# Altium project tclab_v1i1.PrjPcb (part 4 of 4)

## Sheet A6_fan_indicator.SchDoc
size A4; SheetNumber: 6; SheetTotal: 6
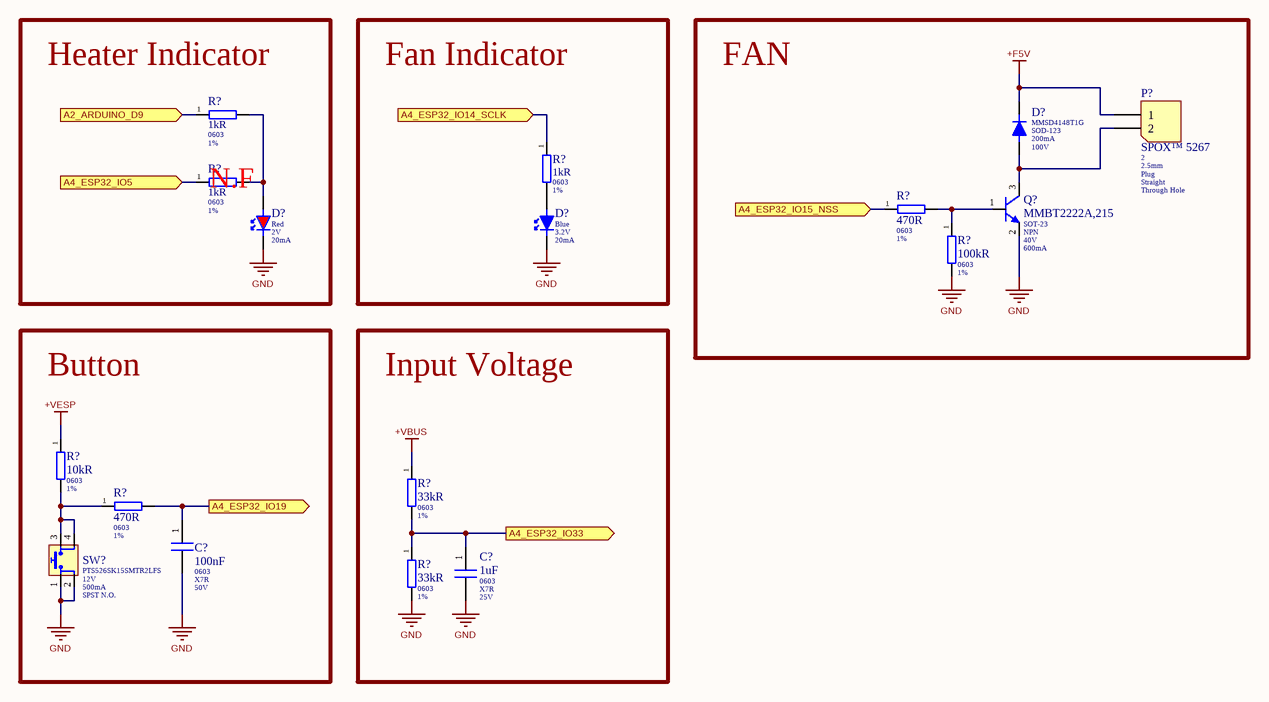
[diagram p5: A6_fan_indicator.SchDoc]

### Parts
(Parts that share a designator on the sheet are numbered #1, #2 ... from top to bottom, then left to right.)
C?#19  Capacitance: 100nF  Case/Package: 0603  Dielectric: X7R  Voltage Rating (DC): 50V  [CAPC1608X09N]  (hidden comment: CAP-CER_100n_50V_20%_X7R_0603)
C?#20  Capacitance: 1uF  Case/Package: 0603  Dielectric: X7R  Voltage: 25V  [CAPC1608X10N]  (hidden comment: CAP-CER_1u_25V_10%_X7R_0603)
D?#3  MFG PN: MMSD4148T1G  Case/Package: SOD-123  Forward Current: 200mA  Reverse Voltage: 100V  [ONSEMI_MMSD4148T1G]  (hidden comment: DIO-F_1000mV_100V_200mA_SOD123)
D?#4  Color: Red  Forward Voltage: 2V  Test Current: 20mA  [LEDC1608X08N_R]  (hidden comment: LED_red_2V_20mA_0603)
D?#5  Color: Blue  Forward Voltage: 3.2V  Test Current: 20mA  [LEDC1608X08N_B]  (hidden comment: LED_blue_3.2V_20mA_0603)
P?#10  Series: SPOX™ 5267  Number of Circuits: 2  Pitch: 2.5mm  _Mating_Type: Plug  Orientation: Straight  Mounting Technology: Through Hole  [MOLEX_22035025]  (hidden comment: CON-5267_02_250_plug_ST_TH)
Q?#7  MFG PN: MMBT2222A,215  Case/Package: SOT-23  Polarity: NPN  Collector Emitter Voltage (VCEO): 40V  Max Collector Current: 600mA  [SOT95P230X110-3N]  (hidden comment: TRNS-NPN_40V_600mA_SOT-23)
R?#49  Resistance: 1kR  Case/Package: 0603  Tolerance: 1%  [RESC1608X06N]  (hidden comment: RES_1K_100mW_1%_0603)
R?#50  Resistance: 1kR  Case/Package: 0603  Tolerance: 1%  [RESC1608X06N]  (hidden comment: RES_1K_100mW_1%_0603)
R?#51  Resistance: 1kR  Case/Package: 0603  Tolerance: 1%  [RESC1608X06N]  (hidden comment: RES_1K_100mW_1%_0603)
R?#52  value 470R  Case/Package: 0603  Tolerance: 1%  [RESC1608X06N]  (hidden comment: RES_470R_100mW_1%_0603)
R?#53  Resistance: 100kR  Case Code (Imperial): 0603  Tolerance: 1%  [RESC1608X06N]  (hidden comment: RES_100K_100mW_1%_0603)
R?#54  Resistance: 10kR  Case/Package: 0603  Tolerance: 1%  [RESC1608X06N]  (hidden comment: RES_10K_100mW_1%_0603)
R?#55  value 33kR  Case/Package: 0603  Tolerance: 1%  [RESC1608X06N]  (hidden comment: RES_33K_100mW_1%_0603)
R?#56  value 470R  Case/Package: 0603  Tolerance: 1%  [RESC1608X06N]  (hidden comment: RES_470R_100mW_1%_0603)
R?#57  value 33kR  Case/Package: 0603  Tolerance: 1%  [RESC1608X06N]  (hidden comment: RES_33K_100mW_1%_0603)
SW?#4  MFG PN: PTS526SK15SMTR2LFS  _Maximum Voltage: 12V  _Maximum Current: 500mA  _Function: SPST N.O.  [CK_PTS526SK15SMTR2LFS]  (hidden comment: SW_Tactile_1_SPST-N.O._12_500m_SMD)

### Blocks framed on the sheet
Heater Indicator: D?#4 R?#49 R?#51
Fan Indicator: D?#5 R?#50
FAN: D?#3 P?#10 Q?#7 R?#52 R?#53
Button: C?#19 R?#54 R?#56 SW?#4
Input Voltage: C?#20 R?#55 R?#57

### Ports
A2_ARDUINO_D9 (in), A4_ESP32_IO5 (in), A4_ESP32_IO14_SCLK (in), A4_ESP32_IO15_NSS (in), A4_ESP32_IO19 (out), A4_ESP32_IO33 (out)

### Nets
+F5V: D?#3.2(K) P?#10.1
+VBUS: R?#55.1
+VESP: R?#54.1
GND: C?#19.2 C?#20.2 D?#4.2(K) D?#5.2(K) Q?#7.2(E) R?#53.2 R?#57.2 SW?#4.1 SW?#4.2
A2_ARDUINO_DIO_D9: R?#49.1 ; port A2_ARDUINO_D9
A4_ESP32_IO5: R?#51.1 ; port A4_ESP32_IO5
A4_ESP32_IO14_SCLK: R?#50.1 ; port A4_ESP32_IO14_SCLK
A4_ESP32_IO15_NSS: R?#52.1 ; port A4_ESP32_IO15_NSS
A4_ESP32_IO19: C?#19.1 R?#56.2 ; port A4_ESP32_IO19
A4_ESP32_IO33: C?#20.1 R?#55.2 R?#57.1 ; port A4_ESP32_IO33
NetD?#3_1: D?#3.1(A) P?#10.2 Q?#7.3(C)
NetD?#4_1: D?#4.1(A) R?#49.2 R?#51.2
NetD?#5_1: D?#5.1(A) R?#50.2
NetQ?#7_1: Q?#7.1(B) R?#52.2 R?#53.1
NetR?#54_2: R?#54.2 R?#56.1 SW?#4.3 SW?#4.4

### Notes on the sheet
- (near R?#51) N.F

### Library data of the parts
C?#19 = Kemet_C0603C104M5RAC: MFG: KEMET; Dielectric Material: Ceramic; Tolerance: 20%; _Checked_PCB: HoP; Supplier 1: Mouser; MFG PN: C0603C104M5RAC; RoHS: Yes; Category: Ceramic Capacitors; Stock 1: 461921; Pricing 1: 1=0.1, 10=0.033, 50=0.033, 100=0.015, 1000=0.009, 10000=0.006 (USD); Mount: Surface Mount; Case Code (Imperial): 0603; Case Code (Metric): 1608; Min Operating Temperature: -55°C; Max Operating Temperature: 125°C; Packaging: Tape and Reel; Package Quantity: 4000; Termination: SMD/SMT; Series: C0603C; Construction: Flat; Length: 1.6mm; Width: 0.8mm; RoHS Compliant: Yes; ComponentLink1URL: http://www.mouser.com/ds/2/212/KEM_C1002_X7R_SMD-1102033.pdf?src-supplier=Mouser; ComponentLink1Description: http://www.mouser.com/ds/2/212/KEM_C1002_X7R_SMD-1102033.pdf?src-supplier=Mouser; Supplier Part Number 1: 80-C0603C104M5RAC; _Checked_SCH: HoP; _Creator: HoP; _SYM_REF: CAP-CER_100n_50V_20%_X7R_0603
C?#20 = Kemet_C0603C105K3RACTU: MFG: KEMET; Dielectric Material: Ceramic; Material: 4241ConductorMaterial; Value: 1uF; Tolerance: 10%; Dissipation Factor: 5%; _Checked_PCB: N.A; _Creator: HoP; Supplier: Mouser; Supplier Part Number: 80-C0603C105K3R; MFG PN: C0603C105K3RACTU; RoHS: Yes; Category: Ceramic Capacitors; Stock: 289732; Pricing: 1=0.25, 10=0.134, 50=0.134, 100=0.094, 1000=0.067, 10000=0.047 (USD); Mounting Technology: Surface Mount; Case Code (Metric): 1608; Case Code (Imperial): 0603; Min Operating Temperature: -55°C; Max Operating Temperature: 125°C; Voltage Rating: 25V; Packaging: Tape and Reel; Package Quantity: 4000; Voltage Rating (DC): 25V; Termination: SMD/SMT; Series: SMD Comm X7R; Construction: Flat; Length: 1.6mm; Width: 0.8mm; Height: 0.8mm; Depth: 0.8mm; Reach SVHC Compliant: No; RoHS Compliant: Yes; ComponentLink1URL: https://datasheet.ciiva.com/7823/1851736-7823596.pdf?src-supplier=Element14; ComponentLink1Description: https://datasheet.ciiva.com/7823/1851736-7823596.pdf?src-supplier=Element14; _Checked_SCH: N.A; _SYM_REF: CAP-CER_1u_25V_10%_X7R_0603
D?#3 = Onsemi_MMSD4148T1G: MFG: onsemi; Reverse Recovery Time: 4ns; Peak Non-Repetitive Surge Current: 2A; Max Reverse Current: 5uA; Element Configuration: Single; Value: 4pF; Forward Voltage: 1V; Power Dissipation: 425mW; Polarity: Standard; _Checked_PCB: N.A; _Checked_SCH: HoP; Current Rating: 200A; Supplier: Digikey; Supplier Part Number: MMSD4148T1GOSCT-ND; RoHS: Yes; Category: Rectifier Diodes; Stock: 114489; Pricing: 1=0.1, 10=0.041, 100=0.0367, 500=0.03214 (USD); Pins: 2; Min Operating Temperature: -55°C; Max Operating Temperature: 150°C; Max Repetitive Reverse Voltage (Vrrm): 100V; Average Rectified Current: 200mA; Recovery Time: 4ns; Max Surge Current: 2A; Package Quantity: 3000; Packaging: Tape and Reel; Max Forward Surge Current (Ifsm): 2A; Max Reverse Voltage (DC): 100V; Series: -; Max Reverse Leakage Current: 5uA; Voltage Rating (DC): 100V; Reverse Recovery Time-Max: 4ns; Output Current: 200mA; Length: 2.69mm; Width: 1.6mm; Height: 1.12mm; Radiation Hardening: No; Lead Free: Lead Free; RoHS Compliant: Yes; Reach SVHC Compliant: No; Halogen Free: 5694HalogenFree; ComponentLink1URL: https://datasheet.ciiva.com/22663/1707241-22663688.pdf?src-supplier=Element14; ComponentLink1Description: https://datasheet.ciiva.com/22663/1707241-22663688.pdf?src-supplier=Element14; ComponentLink2URL: https://datasheet.ciiva.com/8053/mmsd4148t1-d-8053692.pdf?src-supplier=Element14; ComponentLink2Description: https://datasheet.ciiva.com/8053/mmsd4148t1-d-8053692.pdf?src-supplier=Element14; ComponentLink3URL: https://datasheet.ciiva.com/8053/mmsd4148t1-d-8053693.pdf?src-supplier=Element14; ComponentLink3Description: https://datasheet.ciiva.com/8053/mmsd4148t1-d-8053693.pdf?src-supplier=Element14; ComponentLink4URL: https://datasheet.ciiva.com/8299/mmsd4148t1-d-8299883.pdf?src-supplier=Avnet; ComponentLink4Description: https://datasheet.ciiva.com/8299/mmsd4148t1-d-8299883.pdf?src-supplier=Avnet; ComponentLink5URL: https://datasheet.ciiva.com/16368/mmsd4148t1-d-16368570.pdf?src-supplier=Future+Electronics; ComponentLink5Description: https://datasheet.ciiva.com/16368/mmsd4148t1-d-16368570.pdf?src-supplier=Future+Electronics; ComponentLink6URL: https://datasheet.ciiva.com/15144/getdatasheetpartid-78734-15144509.pdf?src-supplier=Verical; ComponentLink6Description: https://datasheet.ciiva.com/15144/getdatasheetpartid-78734-15144509.pdf?src-supplier=Verical; ComponentLink7URL: https://datasheet.ciiva.com/8294/mmsd4148t1-d-8294902.pdf?src-supplier=Avnet; ComponentLink7Description: https://datasheet.ciiva.com/8294/mmsd4148t1-d-8294902.pdf?src-supplier=Avnet; ComponentLink8URL: https://datasheet.ciiva.com/915/mmsd4148t1-d-915384.pdf?src-supplier=Digikey; ComponentLink8Description: https://datasheet.ciiva.com/915/mmsd4148t1-d-915384.pdf?src-supplier=Digikey; ComponentLink9URL: https://datasheet.ciiva.com/915/mmsd4148t1-d-915385.pdf?src-supplier=Digikey; ComponentLink9Description: https://datasheet.ciiva.com/915/mmsd4148t1-d-915385.pdf?src-supplier=Digikey; ComponentLink10URL: https://datasheet.ciiva.com/915/mmsd4148t1-d-915383.pdf?src-supplier=Digikey; ComponentLink10Description: https://datasheet.ciiva.com/915/mmsd4148t1-d-915383.pdf?src-supplier=Digikey; _Creator: HoP; _SYM_REF: DIO-F_1000mV_100V_200mA_SOD123
D?#4 = Wurth_150060RS75000: MFG: Wurth Elektronik; Dominant Wavelength: 625nm; Forward Current: 100mA; Lens Style: Clear, Rectangular; Luminous Intensity: 250mcd; Max Junction Temperature (Tj): 95°C; Max Reverse Voltage (DC): 5V; Peak Wavelength: 630nm; Power Dissipation: 72mW; Viewing Angle: 140°; _Checked_PCB: N.A; _Checked_SCH: HoP; Supplier: DigiKey; Supplier Part Number: 732-4978-1-ND; MFG PN: 150060RS75000; RoHS: Compliant; Category: LEDs; Stock: 405910; Pricing: 1=0.15, 50=0.142, 100=0.1239 (USD); Case/Package: 0603; Case Code (Imperial): 0603; Case Code (Metric): 1608; Height: 700µm; Length: 1.6mm; Max Operating Temperature: 85°C; Min Operating Temperature: -40°C; Mounting Technology: Surface Mount; Packaging: Tape and Reel; REACH SVHC: Unknown; Reverse Voltage: 5V; Wavelength: 625nm; Width: 800µm; ComponentLink1URL: https://datasheet.octopart.com:443/150060RS75000-W%C3%BCrth-Elektronik-datasheet-141913886.pdf?src-supplier=Upverter; ComponentLink1Description: https://datasheet.octopart.com:443/150060RS75000-W%C3%BCrth-Elektronik-datasheet-141913886.pdf?src-supplier=Upverter; ComponentLink2URL: https://datasheet.octopart.com:443/150060RS75000-W%C3%BCrth-Elektronik-datasheet-15983787.pdf?src-supplier=Upverter; ComponentLink2Description: https://datasheet.octopart.com:443/150060RS75000-W%C3%BCrth-Elektronik-datasheet-15983787.pdf?src-supplier=Upverter; ComponentLink3URL: https://datasheet.octopart.com:443/150060RS75000-W%C3%BCrth-Elektronik-datasheet-140603451.pdf?src-supplier=Wurth+Elektronik; ComponentLink3Description: https://datasheet.octopart.com:443/150060RS75000-W%C3%BCrth-Elektronik-datasheet-140603451.pdf?src-supplier=Wurth+Elektronik; ComponentLink4URL: https://datasheet.octopart.com:443/150060RS75000-W%C3%BCrth-Elektronik-datasheet-41196438.pdf?src-supplier=Newark; ComponentLink4Description: https://datasheet.octopart.com:443/150060RS75000-W%C3%BCrth-Elektronik-datasheet-41196438.pdf?src-supplier=Newark; _Creator: HoP; _SYM_REF: LED_red_2V_20mA_0603
D?#5 = Wurth_150060BS75000: MFG: Wurth Elektronik; Dominant Wavelength: 470nm; Forward Current: 100mA; Lens Style: Clear, Rectangular; Luminous Intensity: 145mcd; Max Junction Temperature (Tj): 95°C; Max Reverse Voltage (DC): 5V; Peak Wavelength: 465nm; Power Dissipation: 105mW; Viewing Angle: 140°; _Checked_PCB: N.A; _Checked_SCH: HoP; Supplier: DigiKey; Supplier Part Number: 732-4966-1-ND; MFG PN: 150060BS75000; RoHS: Compliant; Category: LEDs; Stock: 163879; Pricing: 1=0.16, 50=0.155, 100=0.1346 (USD); Case/Package: 0603; Case Code (Imperial): 0603; Case Code (Metric): 1608; Height: 700µm; Length: 1.6mm; Max Operating Temperature: 85°C; Min Operating Temperature: -40°C; Mounting Technology: Surface Mount; Packaging: Tape and Reel; REACH SVHC: Unknown; Reverse Voltage: 5V; Wavelength: 470nm; Width: 800µm; ComponentLink1URL: https://datasheet.octopart.com:443/150060BS75000-W%C3%BCrth-Elektronik-datasheet-140583947.pdf?src-supplier=Newark; ComponentLink1Description: https://datasheet.octopart.com:443/150060BS75000-W%C3%BCrth-Elektronik-datasheet-140583947.pdf?src-supplier=Newark; ComponentLink2URL: https://datasheet.octopart.com:443/150060BS75000-W%C3%BCrth-Elektronik-datasheet-41196436.pdf?src-supplier=Newark; ComponentLink2Description: https://datasheet.octopart.com:443/150060BS75000-W%C3%BCrth-Elektronik-datasheet-41196436.pdf?src-supplier=Newark; ComponentLink3URL: https://datasheet.octopart.com:443/150060BS75000-W%C3%BCrth-Elektronik-datasheet-15983786.pdf?src-supplier=Upverter; ComponentLink3Description: https://datasheet.octopart.com:443/150060BS75000-W%C3%BCrth-Elektronik-datasheet-15983786.pdf?src-supplier=Upverter; _Creator: HoP; _SYM_REF: LED_blue_3.2V_20mA_0603
P?#10 = Molex_22-03-5025: Manufacturer Lifecycle Status: ACTIVE; MFG: Molex; Contact Resistance: 20mΩ; Current Rating: 4A; Dielectric Material: Polyamide; Gender: Male; Glow Wire Compliant: Non-compliant; Insulation Resistance: 1GΩ; Plating: Tin; Plating Thickness: 4.064µm; Shrouded: Yes; Test Voltage: 1kV; Voltage Rating: 250V; _Checked_PCB: N.A; _Checked_SCH: HoP; Supplier: DigiKey; Supplier Part Number: WM18886-ND; MFG PN: 22-03-5025; RoHS: Compliant; Category: Headers and Wire Housings; Stock: 48431; Pricing: 1=0.19, 10=0.165, 100=0.1406, 500=0.12544, 1000=0.11943, 5000=0.1066, 10000=0.10151 (USD); China RoHS: Compliant; Contact Gender: Male; Contact Material: Tin; Contact Plating: Tin; Country of Origin: TW; Flammability Rating: UL94 V-0; Height: 6.1mm; Housing Material: Nylon; Lead Free: Lead Free; Lead Pitch: 2.5mm; Lifecycle Status: Production; Material: Nylon, Polyamide; Max Operating Temperature: 105°C; Min Operating Temperature: -40°C; Number of Contacts: 2; Pins: 2; Number of Poles: 2; Number of Positions: 2; Number of Rows: 1; Packaging: Bulk; Radiation Hardening: No; REACH SVHC: Yes; Schedule B: 8536694040, 8536694040|8536694040|8536694040|8536694040|8536694040|8536694040|8536694040|8536694040|8536694040|8536694040|8536694040|8536694040|8536694040|8536694040|8536694040|8536694040|8536694040|8536694040|8536694040|8536694040|8536694040|8536694040|8536694040|85; Terminal Pitch: 2.5mm; Termination: Through Hole; Voltage Rating (AC): 250V; Voltage Rating (DC): 250V; Working Voltage: 250V; ComponentLink1URL: https://datasheet.octopart.com:443/22-03-5025-Molex-datasheet-138897071.pdf?src-supplier=Sager+Electronics; ComponentLink1Description: https://datasheet.octopart.com:443/22-03-5025-Molex-datasheet-138897071.pdf?src-supplier=Sager+Electronics; ComponentLink2URL: https://datasheet.octopart.com:443/22-03-5025-Molex-datasheet-12527398.pdf?src-supplier=Sager+Electronics; ComponentLink2Description: https://datasheet.octopart.com:443/22-03-5025-Molex-datasheet-12527398.pdf?src-supplier=Sager+Electronics; ComponentLink3URL: https://datasheet.octopart.com:443/022035025-Molex-datasheet-8335231.pdf?src-supplier=Molex; ComponentLink3Description: https://datasheet.octopart.com:443/022035025-Molex-datasheet-8335231.pdf?src-supplier=Molex; ComponentLink4URL: https://datasheet.octopart.com:443/22-03-5025-Molex-datasheet-177722680.pdf?src-supplier=Farnell; ComponentLink4Description: https://datasheet.octopart.com:443/22-03-5025-Molex-datasheet-177722680.pdf?src-supplier=Farnell; ComponentLink5URL: https://datasheet.octopart.com:443/22-03-5025-Molex-datasheet-101581712.pdf?src-supplier=Farnell; ComponentLink5Description: https://datasheet.octopart.com:443/22-03-5025-Molex-datasheet-101581712.pdf?src-supplier=Farnell; ComponentLink6URL: https://datasheet.octopart.com:443/22-03-5025..-Molex-datasheet-41471715.pdf?src-supplier=Farnell; ComponentLink6Description: https://datasheet.octopart.com:443/22-03-5025..-Molex-datasheet-41471715.pdf?src-supplier=Farnell; ComponentLink7URL: https://datasheet.octopart.com:443/22-03-5025-Molex-datasheet-11534747.pdf?src-supplier=Farnell; ComponentLink7Description: https://datasheet.octopart.com:443/22-03-5025-Molex-datasheet-11534747.pdf?src-supplier=Farnell; ComponentLink8URL: https://datasheet.octopart.com:443/22-03-5025-Molex-datasheet-13554370.pdf?src-supplier=Farnell; ComponentLink8Description: https://datasheet.octopart.com:443/22-03-5025-Molex-datasheet-13554370.pdf?src-supplier=Farnell; ComponentLink9URL: https://datasheet.octopart.com:443/22-03-5025-Molex-datasheet-8486621.pdf?src-supplier=Farnell; ComponentLink9Description: https://datasheet.octopart.com:443/22-03-5025-Molex-datasheet-8486621.pdf?src-supplier=Farnell; ComponentLink10URL: https://datasheet.octopart.com:443/22-03-5025-Molex-datasheet-8340226.pdf?src-supplier=Farnell; ComponentLink10Description: https://datasheet.octopart.com:443/22-03-5025-Molex-datasheet-8340226.pdf?src-supplier=Farnell; ComponentLink11URL: https://datasheet.octopart.com:443/22035025-Molex-datasheet-527515.pdf?src-supplier=Farnell; ComponentLink11Description: https://datasheet.octopart.com:443/22035025-Molex-datasheet-527515.pdf?src-supplier=Farnell; ComponentLink12URL: https://datasheet.octopart.com:443/22-03-5025-Molex-datasheet-154746805.pdf?src-supplier=Master+Electronics; ComponentLink12Description: https://datasheet.octopart.com:443/22-03-5025-Molex-datasheet-154746805.pdf?src-supplier=Master+Electronics; ComponentLink13URL: https://datasheet.octopart.com:443/22-03-5025-Molex-datasheet-21206767.pdf?src-supplier=Electro+Sonic; ComponentLink13Description: https://datasheet.octopart.com:443/22-03-5025-Molex-datasheet-21206767.pdf?src-supplier=Electro+Sonic; ComponentLink14URL: https://datasheet.octopart.com:443/22-03-5025-Molex-datasheet-62103328.pdf?src-supplier=Electro+Sonic; ComponentLink14Description: https://datasheet.octopart.com:443/22-03-5025-Molex-datasheet-62103328.pdf?src-supplier=Electro+Sonic; ComponentLink15URL: https://datasheet.octopart.com:443/22-03-5025-Molex-datasheet-37168621.pdf?src-supplier=Electro+Sonic; ComponentLink15Description: https://datasheet.octopart.com:443/22-03-5025-Molex-datasheet-37168621.pdf?src-supplier=Electro+Sonic; ComponentLink16URL: https://datasheet.octopart.com:443/22-03-5025-Molex-datasheet-140180703.pdf?src-supplier=RS+(Formerly+Allied+Electronics); ComponentLink16Description: https://datasheet.octopart.com:443/22-03-5025-Molex-datasheet-140180703.pdf?src-supplier=RS+(Formerly+Allied+Electronics); ComponentLink17URL: https://datasheet.octopart.com:443/22-03-5025-Molex-datasheet-120144827.pdf?src-supplier=RS+(Formerly+Allied+Electronics); ComponentLink17Description: https://datasheet.octopart.com:443/22-03-5025-Molex-datasheet-120144827.pdf?src-supplier=RS+(Formerly+Allied+Electronics); ComponentLink18URL: https://datasheet.octopart.com:443/22-03-5025-Molex-datasheet-34165607.pdf?src-supplier=Newark; ComponentLink18Description: https://datasheet.octopart.com:443/22-03-5025-Molex-datasheet-34165607.pdf?src-supplier=Newark; ComponentLink19URL: https://datasheet.octopart.com:443/22-03-5025-Molex-datasheet-33002182.pdf?src-supplier=Newark; ComponentLink19Description: https://datasheet.octopart.com:443/22-03-5025-Molex-datasheet-33002182.pdf?src-supplier=Newark; ComponentLink20URL: https://datasheet.octopart.com:443/0022035025-Molex-datasheet-11760488.pdf?src-supplier=Arrow+Electronics; ComponentLink20Description: https://datasheet.octopart.com:443/0022035025-Molex-datasheet-11760488.pdf?src-supplier=Arrow+Electronics; ComponentLink21URL: https://datasheet.octopart.com:443/22-03-5025-Molex-datasheet-17741732.pdf?src-supplier=Jameco; ComponentLink21Description: https://datasheet.octopart.com:443/22-03-5025-Molex-datasheet-17741732.pdf?src-supplier=Jameco; ComponentLink22URL: https://datasheet.octopart.com:443/22-03-5025-Molex-datasheet-148009.pdf?src-supplier=DigiKey; ComponentLink22Description: https://datasheet.octopart.com:443/22-03-5025-Molex-datasheet-148009.pdf?src-supplier=DigiKey; ComponentLink23URL: https://datasheet.octopart.com:443/22-03-5025-Molex-datasheet-6553.pdf?src-supplier=TME; ComponentLink23Description: https://datasheet.octopart.com:443/22-03-5025-Molex-datasheet-6553.pdf?src-supplier=TME; ComponentLink24URL: http://sigma.octopart.com:80/16295285/rohs_statement/Molex-22-03-5025.pdf?src-supplier=Compliance+Statements; ComponentLink24Description: http://sigma.octopart.com:80/16295285/rohs_statement/Molex-22-03-5025.pdf?src-supplier=Compliance+Statements; ComponentLink25URL: http://sigma.octopart.com:80/conflict_mineral_statement/Molex-company-72.pdf?src-supplier=Compliance+Statements; ComponentLink25Description: http://sigma.octopart.com:80/conflict_mineral_statement/Molex-company-72.pdf?src-supplier=Compliance+Statements; ComponentLink26URL: http://sigma.octopart.com:80/rohs_statement/Molex-company-73.pdf?src-supplier=Compliance+Statements; ComponentLink26Description: http://sigma.octopart.com:80/rohs_statement/Molex-company-73.pdf?src-supplier=Compliance+Statements; ComponentLink27URL: http://sigma.octopart.com:80/reach_statement/Molex-company-74.pdf?src-supplier=Compliance+Statements; ComponentLink27Description: http://sigma.octopart.com:80/reach_statement/Molex-company-74.pdf?src-supplier=Compliance+Statements; _Creator: HoP; _SYM_REF: CON-5267_02_250_plug_ST_TH
Q?#7 = Nexperia_MMBT2222A,215: Manufacturer Lifecycle Status: RELEASED FOR SUPPLY; Collector Base Voltage (VCBO): 75V; Collector Emitter Saturation Voltage: 1V; Emitter Base Voltage (VEBO): 6V; hFE Min: 40; Max Junction Temperature (Tj): 150°C; Max Power Dissipation: 250mW; Number of Elements: 1; Transition Frequency: 300MHz; _Checked_PCB: N.A; _Checked_SCH: HoP; Supplier: DigiKey; Supplier Part Number: 1727-4043-1-ND; MFG: Nexperia; RoHS: Compliant; Category: BJTs; Stock: 277067; Pricing: 1=0.13, 10=0.081, 100=0.0497, 500=0.0359, 1000=0.0314 (USD); Ambient Temperature Range High: 150°C; China RoHS: Compliant; Contact Plating: Tin; Height: 1.1mm; Lifecycle Status: Production; Max Operating Temperature: 150°C; Min Operating Temperature: -65°C; Pins: 3; Number of Terminals: 3; Power Dissipation: 250mW; REACH SVHC: Yes; Schedule B: 8541210080, 8541210080|8541210080|8541210080|8541210080|8541210080; ComponentLink1URL: https://sigma.octopart.com:443/138797052/technical_drawing/Nexperia-MMBT2222A%2C215.pdf?src-supplier=Upverter; ComponentLink1Description: https://sigma.octopart.com:443/138797052/technical_drawing/Nexperia-MMBT2222A%2C215.pdf?src-supplier=Upverter; ComponentLink2URL: https://datasheet.octopart.com:443/MMBT2222A%2C215-Nexperia-datasheet-87581373.pdf?src-supplier=LKR; ComponentLink2Description: https://datasheet.octopart.com:443/MMBT2222A%2C215-Nexperia-datasheet-87581373.pdf?src-supplier=LKR; ComponentLink3URL: https://datasheet.octopart.com:443/MMBT2222A%2C215-Nexperia-datasheet-8386369.pdf?src-supplier=element14+APAC; ComponentLink3Description: https://datasheet.octopart.com:443/MMBT2222A%2C215-Nexperia-datasheet-8386369.pdf?src-supplier=element14+APAC; ComponentLink4URL: https://datasheet.octopart.com:443/MMBT2222A%2C215-Nexperia-datasheet-8884867.pdf?src-supplier=element14+APAC; ComponentLink4Description: https://datasheet.octopart.com:443/MMBT2222A%2C215-Nexperia-datasheet-8884867.pdf?src-supplier=element14+APAC; ComponentLink5URL: https://datasheet.octopart.com:443/MMBT2222A%2C215-Nexperia-datasheet-180923983.pdf?src-supplier=IHS; ComponentLink5Description: https://datasheet.octopart.com:443/MMBT2222A%2C215-Nexperia-datasheet-180923983.pdf?src-supplier=IHS; ComponentLink6URL: https://datasheet.octopart.com:443/MMBT2222A%2C215-Philips-datasheet-14064901.pdf?src-supplier=iiiC; ComponentLink6Description: https://datasheet.octopart.com:443/MMBT2222A%2C215-Philips-datasheet-14064901.pdf?src-supplier=iiiC; ComponentLink7URL: http://sigma.octopart.com:80/rohs_statement/NXP-Semiconductors-company-12.pdf?src-supplier=Compliance+Statements; ComponentLink7Description: http://sigma.octopart.com:80/rohs_statement/NXP-Semiconductors-company-12.pdf?src-supplier=Compliance+Statements; ComponentLink8URL: http://sigma.octopart.com:80/reach_statement/NXP-Semiconductors-company-13.pdf?src-supplier=Compliance+Statements; ComponentLink8Description: http://sigma.octopart.com:80/reach_statement/NXP-Semiconductors-company-13.pdf?src-supplier=Compliance+Statements; _Creator: HoP; _SYM_REF: TRNS-NPN_40V_600mA_SOT-23
R?#49-R?#51 = Yageo_RC0603FR-071KL: MFG: Yageo; Temperature Coefficient: 100ppm/°C; Power Rating: 100mW; Voltage Rating: 50V; _Checked_PCB: HoP; _Value: 1000; Supplier 1: Mouser; MFG PN: RC0603FR-071KL; RoHS: Yes; Category: Chip SMD Resistors; Stock 1: 9806849; Pricing 1: 1=0.1, 10=0.019, 50=0.019, 100=0.007, 1000=0.004, 10000=0.002 (USD); Contact Plating: Tin,Matte; Case Code (Imperial): 0603; Case Code (Metric): 1608; Size Code: 0603; Min Operating Temperature: -55°C; Max Operating Temperature: 155°C; Resistor Type: Thick Film; Packaging: Tape and Reel; Termination: SMD/SMT; Features: Moisture Resistant; Series: RC; Max Power Dissipation: 100mW; Number of Terminations: 2; Technology: THICK FILM; Resistance Tolerance: 1%; Construction: Rectangular; Length: 1.6mm; Height: 0.45mm; Depth: 0.8mm; Reach SVHC Compliant: No; Lead Free: Lead Free; Military Standard: Not; RoHS Compliant: Yes; Supplier Part Number 1: 603-RC0603FR-071KL; _Checked_SCH: HoP; _Creator: HoP; _SYM_REF: RES_1K_100mW_1%_0603
R?#52 R?#56 = Yageo_RC0603FR-07470RL: MFG: Yageo; Power Rating: 100mW; Voltage Rating: 50V; Temperature Coefficient: 100ppm/°C; Working Voltage: 75V; Impedance: 50R; _Checked_PCB: N.A; _Checked_SCH: HoP; _Value: 470; Supplier: Mouser; Supplier Part Number: 603-RC0603FR-07470RL; MFG PN: RC0603FR-07470RL; RoHS: Yes; Category: Chip SMD Resistors; Stock: 209227; Pricing: 1=0.1, 10=0.008, 50=0.008, 100=0.007, 1000=0.006, 10000=0.002 (USD); Case Code (Metric): 1608; Case Code (Imperial): 0603; Contact Material: 152ConductorMaterial; Contact Plating: 157ConductorMaterial; Min Operating Temperature: -55°C; Max Operating Temperature: 155°C; Packaging: Tape and Reel; Number of Terminations: 2; Termination: SMD/SMT; Max Power Dissipation: 100mW; Features: Moisture Resistant; Package Quantity: 1; Resistor Type: Thick Film; Series: RC; Technology: THICK FILM; Length: 0.063inch; Width: 0.031inch; Height: 0.022inch; Depth: 0.8mm; Radiation Hardening: 5898YesNo; Reach SVHC Compliant: No; Lead Free: Lead Free; RoHS Compliant: Yes; ComponentLink1URL: https://datasheet.ciiva.com/11808/0900766b80f96399-11808177.pdf?src-supplier=Rs; ComponentLink1Description: https://datasheet.ciiva.com/11808/0900766b80f96399-11808177.pdf?src-supplier=Rs; ComponentLink2URL: https://datasheet.ciiva.com/7660/1868787-7660793.pdf?src-supplier=Element14; ComponentLink2Description: https://datasheet.ciiva.com/7660/1868787-7660793.pdf?src-supplier=Element14; ComponentLink3URL: https://datasheet.ciiva.com/46440/1868787-46440907.pdf?src-supplier=Element14; ComponentLink3Description: https://datasheet.ciiva.com/46440/1868787-46440907.pdf?src-supplier=Element14; ComponentLink4URL: https://datasheet.ciiva.com/2454/pyu-r-int-thick-7-2454013.pdf?src-supplier=Digikey; ComponentLink4Description: https://datasheet.ciiva.com/2454/pyu-r-int-thick-7-2454013.pdf?src-supplier=Digikey; ComponentLink5URL: https://datasheet.ciiva.com/2454/pyu-r-int-thick-7-2454014.pdf?src-supplier=Digikey; ComponentLink5Description: https://datasheet.ciiva.com/2454/pyu-r-int-thick-7-2454014.pdf?src-supplier=Digikey; ComponentLink6URL: https://datasheet.ciiva.com/2454/pyu-r-int-thick-7-2454012.pdf?src-supplier=Digikey; ComponentLink6Description: https://datasheet.ciiva.com/2454/pyu-r-int-thick-7-2454012.pdf?src-supplier=Digikey; ComponentLink7URL: https://datasheet.ciiva.com/7746/1738695-7746360.pdf?src-supplier=Element14; ComponentLink7Description: https://datasheet.ciiva.com/7746/1738695-7746360.pdf?src-supplier=Element14; ComponentLink8URL: https://datasheet.ciiva.com/7746/1738695-7746359.pdf?src-supplier=Element14; ComponentLink8Description: https://datasheet.ciiva.com/7746/1738695-7746359.pdf?src-supplier=Element14; _Creator: HoP; _SYM_REF: RES_470R_100mW_1%_0603; Resistance Tolerance: 1%
R?#53 = Yageo_RC0603FR-07100KL: MFG: Yageo; Temperature Coefficient: 100ppm/°C; Max Power Dissipation: 100mW; Voltage Rating: 50V; _Creator: HoP; _Value: 100000; Supplier 1: Mouser; MFG PN: RC0603FR-07100KL; RoHS: Yes; Category: Chip SMD Resistors; Stock 1: 5127875; Pricing 1: 1=0.1, 10=0.017, 50=0.017, 100=0.008, 1000=0.004, 10000=0.004 (USD); Case/Package: 0603; Number of Pins: 2; Case Code (Metric): 1608; Min Operating Temperature: -55°C; Max Operating Temperature: 155°C; Packaging: Tape and Reel; Series: RC; Number of Terminations: 2; Power Rating: 100mW; Features: Moisture Resistant; Termination: SMD/SMT; Voltage Rating (DC): 50V; Resistance Tolerance: 1%; Resistor Type: Thick Film; Construction: Rectangular; Technology: THICK FILM; Length: 1.6mm; Width: 0.8mm; Height: 0.45mm; Depth: 0.8mm; RoHS Compliant: Yes; Lead Free: Lead Free; Reach SVHC Compliant: No; Military Standard: Not; ComponentLink1URL: https://datasheet.ciiva.com/11808/0900766b80f96399-11808107.pdf?src-supplier=Rs; ComponentLink1Description: https://datasheet.ciiva.com/11808/0900766b80f96399-11808107.pdf?src-supplier=Rs; ComponentLink2URL: https://datasheet.ciiva.com/7983/443971-7983593.pdf?src-supplier=Element14; ComponentLink2Description: https://datasheet.ciiva.com/7983/443971-7983593.pdf?src-supplier=Element14; ComponentLink3URL: https://datasheet.ciiva.com/22747/443971-22747516.pdf?src-supplier=Element14; ComponentLink3Description: https://datasheet.ciiva.com/22747/443971-22747516.pdf?src-supplier=Element14; ComponentLink4URL: https://datasheet.ciiva.com/46440/1868787-46440889.pdf?src-supplier=Element14; ComponentLink4Description: https://datasheet.ciiva.com/46440/1868787-46440889.pdf?src-supplier=Element14; ComponentLink5URL: https://datasheet.ciiva.com/7746/1738695-7746235.pdf?src-supplier=Element14; ComponentLink5Description: https://datasheet.ciiva.com/7746/1738695-7746235.pdf?src-supplier=Element14; ComponentLink6URL: https://datasheet.ciiva.com/7746/1738695-7746234.pdf?src-supplier=Element14; ComponentLink6Description: https://datasheet.ciiva.com/7746/1738695-7746234.pdf?src-supplier=Element14; Supplier Part Number 1: 603-RC0603FR-07100KL; _Checked_SCH: HoP; _Checked_PCB: HoP; _SYM_REF: RES_100K_100mW_1%_0603
R?#54 = Yageo_RC0603FR-0710KL: MFG: Yageo; Temperature Coefficient: 100ppm/°C; Voltage Rating (DC): 50V; Power Rating: 100mW; Voltage Rating: 75V; _Checked_PCB: HoP; _Checked_SCH: HoP_V1-1; _Value: 10000; Supplier 1: Mouser; MFG PN: RC0603FR-0710KL; RoHS: Yes; Category: Chip SMD Resistors; Stock 1: 13284125; Pricing 1: 1=0.1, 10=0.016, 50=0.016, 100=0.008, 1000=0.005, 10000=0.003 (USD); Number of Pins: 2; Case Code (Imperial): 0603; Case Code (Metric): 1608; Weight: 7.1E-05oz; Size Code: 0603; Min Operating Temperature: -55°C; Max Operating Temperature: 155°C; Resistor Type: Thick Film; Packaging: Tape and Reel; Termination: SMD/SMT; Features: Moisture Resistant; Series: RC; Max Power Dissipation: 100mW; Number of Terminations: 2; Resistance Tolerance: 1%; Construction: Rectangular; Length: 1.6mm; Width: 0.8mm; Height: 0.45mm; Depth: 0.8mm; Lead Pitch: 0.3mm; Reach SVHC Compliant: No; Lead Free: Lead Free; Military Standard: Not; RoHS Compliant: Yes; ComponentLink1URL: https://datasheet.ciiva.com/7660/38590-7660789.pdf?src-supplier=Element14; ComponentLink1Description: https://datasheet.ciiva.com/7660/38590-7660789.pdf?src-supplier=Element14; ComponentLink2URL: https://datasheet.ciiva.com/7983/443971-7983596.pdf?src-supplier=Element14; ComponentLink2Description: https://datasheet.ciiva.com/7983/443971-7983596.pdf?src-supplier=Element14; ComponentLink3URL: https://datasheet.ciiva.com/22747/443971-22747519.pdf?src-supplier=Element14; ComponentLink3Description: https://datasheet.ciiva.com/22747/443971-22747519.pdf?src-supplier=Element14; ComponentLink4URL: https://datasheet.ciiva.com/46440/1868787-46440891.pdf?src-supplier=Element14; ComponentLink4Description: https://datasheet.ciiva.com/46440/1868787-46440891.pdf?src-supplier=Element14; ComponentLink5URL: https://datasheet.ciiva.com/7746/1738695-7746239.pdf?src-supplier=Element14; ComponentLink5Description: https://datasheet.ciiva.com/7746/1738695-7746239.pdf?src-supplier=Element14; ComponentLink6URL: https://datasheet.ciiva.com/15189/getdatasheetpartid-409289-15189591.pdf?src-supplier=Verical; ComponentLink6Description: https://datasheet.ciiva.com/15189/getdatasheetpartid-409289-15189591.pdf?src-supplier=Verical; Supplier Part Number 1: 603-RC0603FR-0710KL; _Creator: HoP; _SYM_REF: RES_10K_100mW_1%_0603
R?#55 R?#57 = Yageo_RC0603FR-0733KL: MFG: Yageo Group; Max Power Dissipation: 100mW; Temperature Coefficient: 100ppm/°C; Voltage Rating: 75V; Voltage Rating (AC): 50V; _Checked_PCB: N.A; _Checked_SCH: HoP; _Value: 33000; Supplier: DigiKey; Supplier Part Number: 311-33.0KHRCT-ND; MFG PN: RC0603FR-0733KL; RoHS: Compliant; Category: Chip SMD Resistors; Stock: 133503; Pricing: 1=0.1, 10=0.008, 25=0.0076, 50=0.0052 (USD); Case Code (Imperial): 0603; Case Code (Metric): 0603; China RoHS: Non-Compliant; Composition: Thick Film; Depth: 800µm; Features: Moisture Resistant; Height: 450µm; Lead Free: Lead Free; Length: 1.6mm; Lifecycle Status: Production; Max Operating Temperature: 155°C; Military Standard: Not; Min Operating Temperature: -55°C; Mounting Technology: Surface Mount; Pins: 2; Number of Terminals: 2; Number of Terminations: 2; Packaging: Tape & Reel; Power Dissipation: 100mW; Power Rating: 100mW; REACH SVHC: Yes; Schedule B: 8533210045, 8533210045|8533210045, 8533210045|8533210045|8533210045, 8533210045|8533210045|8533210045|8533210045; Termination: SMD/SMT; Voltage Rating (DC): 50V; Width: 800µm; Working Voltage: 75V; ComponentLink1URL: https://datasheet.octopart.com:443/RC0603FR-0733KL-Yageo-datasheet-175887523.pdf?src-supplier=IHS; ComponentLink1Description: https://datasheet.octopart.com:443/RC0603FR-0733KL-Yageo-datasheet-175887523.pdf?src-supplier=IHS; ComponentLink2URL: https://datasheet.octopart.com:443/RC0603FR-0733KL-Yageo-datasheet-103092701.pdf?src-supplier=Upverter; ComponentLink2Description: https://datasheet.octopart.com:443/RC0603FR-0733KL-Yageo-datasheet-103092701.pdf?src-supplier=Upverter; ComponentLink3URL: https://datasheet.octopart.com:443/RC0603FR-0733KL-Yageo-datasheet-8328172.pdf?src-supplier=element14+APAC; ComponentLink3Description: https://datasheet.octopart.com:443/RC0603FR-0733KL-Yageo-datasheet-8328172.pdf?src-supplier=element14+APAC; ComponentLink4URL: https://datasheet.octopart.com:443/RC0603FR-0733KL-Yageo-datasheet-62067350.pdf?src-supplier=element14+APAC; ComponentLink4Description: https://datasheet.octopart.com:443/RC0603FR-0733KL-Yageo-datasheet-62067350.pdf?src-supplier=element14+APAC; ComponentLink5URL: https://datasheet.octopart.com:443/RC0603FR-0733KL-Yageo-datasheet-164759695.pdf?src-supplier=Future+Electronics; ComponentLink5Description: https://datasheet.octopart.com:443/RC0603FR-0733KL-Yageo-datasheet-164759695.pdf?src-supplier=Future+Electronics; ComponentLink6URL: https://datasheet.octopart.com:443/RC0603FR-0733KL-Yageo-datasheet-127823281.pdf?src-supplier=Future+Electronics; ComponentLink6Description: https://datasheet.octopart.com:443/RC0603FR-0733KL-Yageo-datasheet-127823281.pdf?src-supplier=Future+Electronics; ComponentLink7URL: https://datasheet.octopart.com:443/RC0603FR-0733KL-Yageo-datasheet-137700087.pdf?src-supplier=Future+Electronics; ComponentLink7Description: https://datasheet.octopart.com:443/RC0603FR-0733KL-Yageo-datasheet-137700087.pdf?src-supplier=Future+Electronics; ComponentLink8URL: https://datasheet.octopart.com:443/RC0603FR-0733KL-Yageo-datasheet-27584510.pdf?src-supplier=Future+Electronics; ComponentLink8Description: https://datasheet.octopart.com:443/RC0603FR-0733KL-Yageo-datasheet-27584510.pdf?src-supplier=Future+Electronics; ComponentLink9URL: https://datasheet.octopart.com:443/RC0603FR-0733KL-Yageo-datasheet-15599030.pdf?src-supplier=Future+Electronics; ComponentLink9Description: https://datasheet.octopart.com:443/RC0603FR-0733KL-Yageo-datasheet-15599030.pdf?src-supplier=Future+Electronics; ComponentLink10URL: https://datasheet.octopart.com:443/RC0603FR-0733KL-Yageo-datasheet-12596169.pdf?src-supplier=Future+Electronics; ComponentLink10Description: https://datasheet.octopart.com:443/RC0603FR-0733KL-Yageo-datasheet-12596169.pdf?src-supplier=Future+Electronics; ComponentLink11URL: https://datasheet.octopart.com:443/RC0603FR-0733KL-Yageo-datasheet-8324193.pdf?src-supplier=Future+Electronics; ComponentLink11Description: https://datasheet.octopart.com:443/RC0603FR-0733KL-Yageo-datasheet-8324193.pdf?src-supplier=Future+Electronics; ComponentLink12URL: https://datasheet.octopart.com:443/RC0603FR-0733KL-Yageo-datasheet-148775077.pdf?src-supplier=TME; ComponentLink12Description: https://datasheet.octopart.com:443/RC0603FR-0733KL-Yageo-datasheet-148775077.pdf?src-supplier=TME; ComponentLink13URL: https://datasheet.octopart.com:443/RC0603FR-0733KL-Yageo-datasheet-79472498.pdf?src-supplier=Megastar; ComponentLink13Description: https://datasheet.octopart.com:443/RC0603FR-0733KL-Yageo-datasheet-79472498.pdf?src-supplier=Megastar; ComponentLink14URL: https://datasheet.octopart.com:443/RC0603FR-0733KL-Yageo-datasheet-34211833.pdf?src-supplier=Newark; ComponentLink14Description: https://datasheet.octopart.com:443/RC0603FR-0733KL-Yageo-datasheet-34211833.pdf?src-supplier=Newark; ComponentLink15URL: https://datasheet.octopart.com/RC0603FR-0733KL-Yageo-datasheet-73766026.pdf; ComponentLink15Description: https://datasheet.octopart.com/RC0603FR-0733KL-Yageo-datasheet-73766026.pdf; ComponentLink16URL: https://datasheet.octopart.com:443/RC0603FR-0733KL-Yageo-datasheet-13691069.pdf?src-supplier=Farnell; ComponentLink16Description: https://datasheet.octopart.com:443/RC0603FR-0733KL-Yageo-datasheet-13691069.pdf?src-supplier=Farnell; ComponentLink17URL: https://datasheet.octopart.com:443/RC0603FR-0733KL-Yageo-datasheet-118562.pdf?src-supplier=DigiKey; ComponentLink17Description: https://datasheet.octopart.com:443/RC0603FR-0733KL-Yageo-datasheet-118562.pdf?src-supplier=DigiKey; ComponentLink18URL: http://sigma.octopart.com:80/rohs_statement/Yageo-company-2.pdf?src-supplier=Compliance+Statements; ComponentLink18Description: http://sigma.octopart.com:80/rohs_statement/Yageo-company-2.pdf?src-supplier=Compliance+Statements; ComponentLink19URL: http://sigma.octopart.com:80/conflict_mineral_statement/Yageo-company-3.pdf?src-supplier=Compliance+Statements; ComponentLink19Description: http://sigma.octopart.com:80/conflict_mineral_statement/Yageo-company-3.pdf?src-supplier=Compliance+Statements; _Creator: HoP; _SYM_REF: RES_33K_100mW_1%_0603
SW?#4 = CK_PTS526SK15SMTR2LFS: MFG: ITT C&K; _Checked_PCB: HoP; Supplier 1: Mouser; RoHS: No; Category: Uncategorized; Stock 1: 68360; Pricing 1: 1=0.13, 10=0.128, 50=0.128, 100=0.11, 1000=0.079, 10000=0.067 (USD); Supplier Part Number 1: 611-PTS526SK15SMR2L; _Checked_SCH: HoP; _Creator: HoP; _SYM_REF: SW_Tactile_1_SPST-N.O._12_500m_SMD

## Nets that join several sheets
+5V: A1_pmu (C?#3.1 D?#1.2 U?#1.3), A2_shield (P?#2.5 P?#3.5 U?#2.5 U?#2.38), A3_plants (10 pins)
+F5V: A1_pmu (5 pins), A3_plants (Q?#1.3 Q?#2.3 R?#7.1 R?#8.1), A6_fan_indicator (D?#3.2 P?#10.1)
+VBUS: A1_pmu (5 pins), A5_sub_interface (C?#16.1 U?#11.8), A6_fan_indicator (R?#55.1)
+VESP: A1_pmu (C?#4.1 U?#1.1), A4_esp32 (10 pins), A5_sub_interface (6 pins), A6_fan_indicator (R?#54.1)
GND: A1_pmu (16 pins), A2_shield (12 pins), A3_plants (20 pins), A4_esp32 (11 pins), A5_sub_interface (5 pins), A6_fan_indicator (9 pins)
A1_USB_DATA_N: A1_pmu (J?.A7 J?.B7), A5_sub_interface (R?#46.1)
A1_USB_DATA_P: A1_pmu (J?.A6 J?.B6), A5_sub_interface (R?#45.1)
A2_ARDUINO_ADIO_A0: A2_shield (P?#6.1 P?#7.1 U?#2.9), A3_plants (R?#27.2)
A2_ARDUINO_ADIO_A1: A2_shield (P?#6.2 P?#7.2 U?#2.10), A3_plants (R?#29.2)
A2_ARDUINO_ADIO_A2: A2_shield (P?#6.3 P?#7.3 U?#2.11), A3_plants (R?#28.2)
A2_ARDUINO_DIO_D3: A2_shield (P?#8.4 P?#9.4 U?#2.18), A3_plants (R?#19.1 R?#22.1)
A2_ARDUINO_DIO_D5: A2_shield (P?#8.6 P?#9.6 U?#2.20), A3_plants (R?#20.1 R?#21.1)
A2_ARDUINO_DIO_D9: A2_shield (P?#4.2 P?#5.2 U?#2.24), A6_fan_indicator (R?#49.1)
A4_ESP32_IO1_TXD: A4_esp32 (U?#10.35), A5_sub_interface (R?#48.2)
A4_ESP32_IO3_RXD: A4_esp32 (U?#10.34), A5_sub_interface (R?#47.2)
A4_ESP32_IO4: A2_shield (C?#5.1), A4_esp32 (U?#10.26)
A4_ESP32_IO5: A4_esp32 (U?#10.29), A6_fan_indicator (R?#51.1)
A4_ESP32_IO12_MISO: A3_plants (R?#17.1), A4_esp32 (R?#37.2 U?#8.14)
A4_ESP32_IO13_MOSI: A3_plants (R?#18.1), A4_esp32 (R?#36.2 U?#9.16)
A4_ESP32_IO14_SCLK: A4_esp32 (R?#35.2 U?#8.13), A6_fan_indicator (R?#50.1)
A4_ESP32_IO15_NSS: A4_esp32 (R?#34.2 U?#9.23), A6_fan_indicator (R?#52.1)
A4_ESP32_IO16: A2_shield (R?#5.1), A4_esp32 (U?#10.27)
A4_ESP32_IO17: A2_shield (R?#6.1), A4_esp32 (U?#10.28)
A4_ESP32_IO19: A4_esp32 (U?#10.31), A6_fan_indicator (C?#19.1 R?#56.2)
A4_ESP32_IO32: A3_plants (R?#32.2), A4_esp32 (U?#8.8)
A4_ESP32_IO33: A4_esp32 (U?#8.9), A6_fan_indicator (C?#20.1 R?#55.2 R?#57.1)
A4_ESP32_IO34: A3_plants (R?#30.2), A4_esp32 (U?#8.6)
A4_ESP32_IO35: A3_plants (R?#31.2), A4_esp32 (U?#8.7)
A4_ESP32_IO36_SVP: A3_plants (C?#8.1 R?#14.2), A4_esp32 (U?#8.4)
A4_ESP32_IO39_SVN: A3_plants (C?#9.1 R?#16.2), A4_esp32 (U?#8.5)
A5_CP2104_DTR: A4_esp32 (Q?#5.2 R?#42.1), A5_sub_interface (U?#12.23)
A5_CP2104_RTS: A4_esp32 (Q?#6.2 R?#40.1), A5_sub_interface (U?#12.19)